# Altium schematic sheet ecen201_blank_pcb.SchDoc
size A4
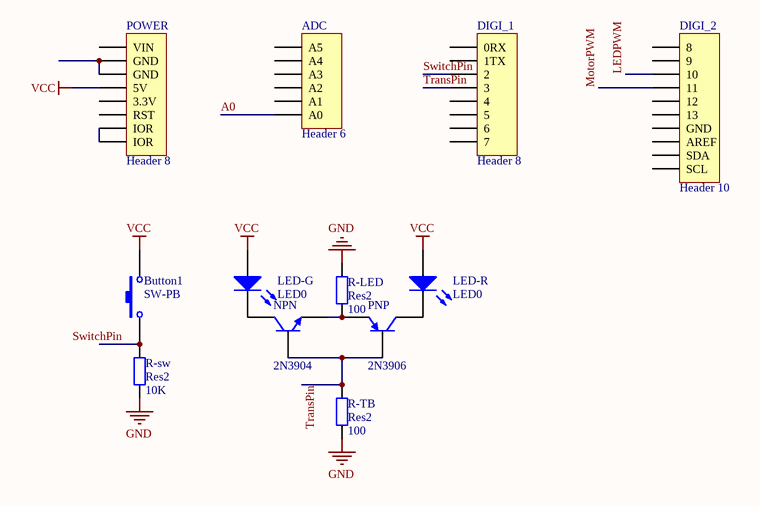
[diagram p0: ecen201_blank_pcb.SchDoc]

## Parts
ADC  Header 6  [HDR1X6]
Button1  SW-PB  [SPST-2]
DIGI_1  Header 8  [HDR1X8]
DIGI_2  Header 10  [HDR1X10]
LED-G  LED0  [LED-0]
LED-R  LED0  [LED-0]
NPN  2N3904  [TO-92A]
PNP  2N3906  [TO-92A]
POWER  Header 8  [HDR1X8]
R-LED  Res2  value 100  [AXIAL-0.4]
R-sw  Res2  value 10K  [AXIAL-0.4]
R-TB  Res2  value 100  [AXIAL-0.4]

## Nets
GND: R-LED.1 R-sw.1 R-TB.1
VCC: Button1.2 LED-G.1(A) LED-R.1(A) POWER.4(5V)
A0: ADC.6(A0)
LEDPWM: DIGI_2.3(10)
MotorPWM: DIGI_2.4(11)
SwitchPin: DIGI_1.3(2)
TransPin: DIGI_1.4(3) NPN.2(B) PNP.2(B) R-TB.2
NetButton1_1: Button1.1 R-sw.2
NetLED-G_2: LED-G.2(K) NPN.3(C)
NetLED-R_2: LED-R.2(K) PNP.3(C)
NetNPN_1: NPN.1(E) PNP.1(E) R-LED.2
NetPOWER_2: POWER.2(GND) POWER.3(GND)
NetPOWER_7: POWER.7(IOR) POWER.8(IOR)

Not connected (* = marked no-connect by the designer): ADC 1(A5) 2(A4) 3(A3) 4(A2) 5(A1); DIGI_1 1(0RX) 2(1TX) 5(4) 6(5) 7(6) 8(7); DIGI_2 1(8) 2(9) 5(12) 6(13) 7(GND) 8(AREF) 9(SDA) 10(SCL); POWER 1(VIN) 5(3.3V) 6(RST)

## Notes on the sheet
- Labels drawn without touching a wire or pin: SwitchPin

## Library data of the parts
ADC = Header 6: Header, 6-Pin; LatestRevisionDate: 17-Jul-2002; LatestRevisionNote: Re-released for DXP Platform.; Publisher: Altium Limited
Button1 = SW-PB: Switch; Published: 24-Mar-1999; LatestRevisionDate: 17-Jul-2002; LatestRevisionNote: Re-released for DXP Platform.; PackageReference: SPST-2; Publisher: Altium Limited; PackageDescription: Switch; 2 Leads
DIGI_1 POWER = Header 8: Header, 8-Pin; LatestRevisionDate: 17-Jul-2002; LatestRevisionNote: Re-released for DXP Platform.; Publisher: Altium Limited
DIGI_2 = Header 10: Header, 10-Pin; LatestRevisionDate: 17-Jul-2002; LatestRevisionNote: Re-released for DXP Platform.; Publisher: Altium Limited
LED-G LED-R = LED0: Typical INFRARED GaAs LED; Published: 8-Jun-2000; LatestRevisionDate: 08-Jul-2005; LatestRevisionNote: Mech Layer 1 removed.; PackageReference: LED-0; Publisher: Altium Limited; PackageDescription: LED; 2 Leads
NPN = 2N3904: NPN General Purpose Amplifier; Published: 8-Jun-2000; LatestRevisionDate: 15-Jan-2003; LatestRevisionNote: PCB Footprint 'BCY-W3/D4.7' replaced; DatasheetVersion: 1997; PackageVersion: Sep-1998; PackageReference: TO-92A; Publisher: Altium Limited; PackageDescription: TO, Flat Index; 3 In-Line, Axial Leads; Body Dia. 4.5mm; Leads 0.51 x 0.48 mm (max); ComponentLink1Description: Manufacturer Link; ComponentLink1URL: http://www.fairchildsemi.com/; ComponentLink2Description: Datasheet; ComponentLink2URL: http://www.fairchildsemi.com/ds/2N%2F2N3904.pdf
PNP = 2N3906: PNP General Purpose Amplifier; Published: 8-Jun-2000; LatestRevisionDate: 15-Jan-2003; LatestRevisionNote: PCB Footprint 'BCY-W3/D4.7' replaced; DatasheetVersion: 1997; PackageVersion: Sep-1998; PackageReference: TO-92A; Publisher: Altium Limited; PackageDescription: TO, Flat Index; 3 In-Line, Axial Leads; Body Dia. 4.5mm; Leads 0.51 x 0.48 mm (max); ComponentLink1Description: Manufacturer Link; ComponentLink1URL: http://www.fairchildsemi.com/; ComponentLink2Description: Datasheet; ComponentLink2URL: http://www.fairchildsemi.com/ds/2N%2F2N3906.pdf
R-LED R-sw R-TB = Res2: Resistor; Published: 8-Jun-2000; LatestRevisionDate: 17-Jul-2002; LatestRevisionNote: Re-released for DXP Platform.; PackageReference: AXIAL-0.4; Publisher: Altium Limited; PackageDescription: Axial Device, Thru-Hole; 2 Leads; 0.4 in Pin Spacing